# EAGLE schematic control_board (EAGLE 9.5.0)
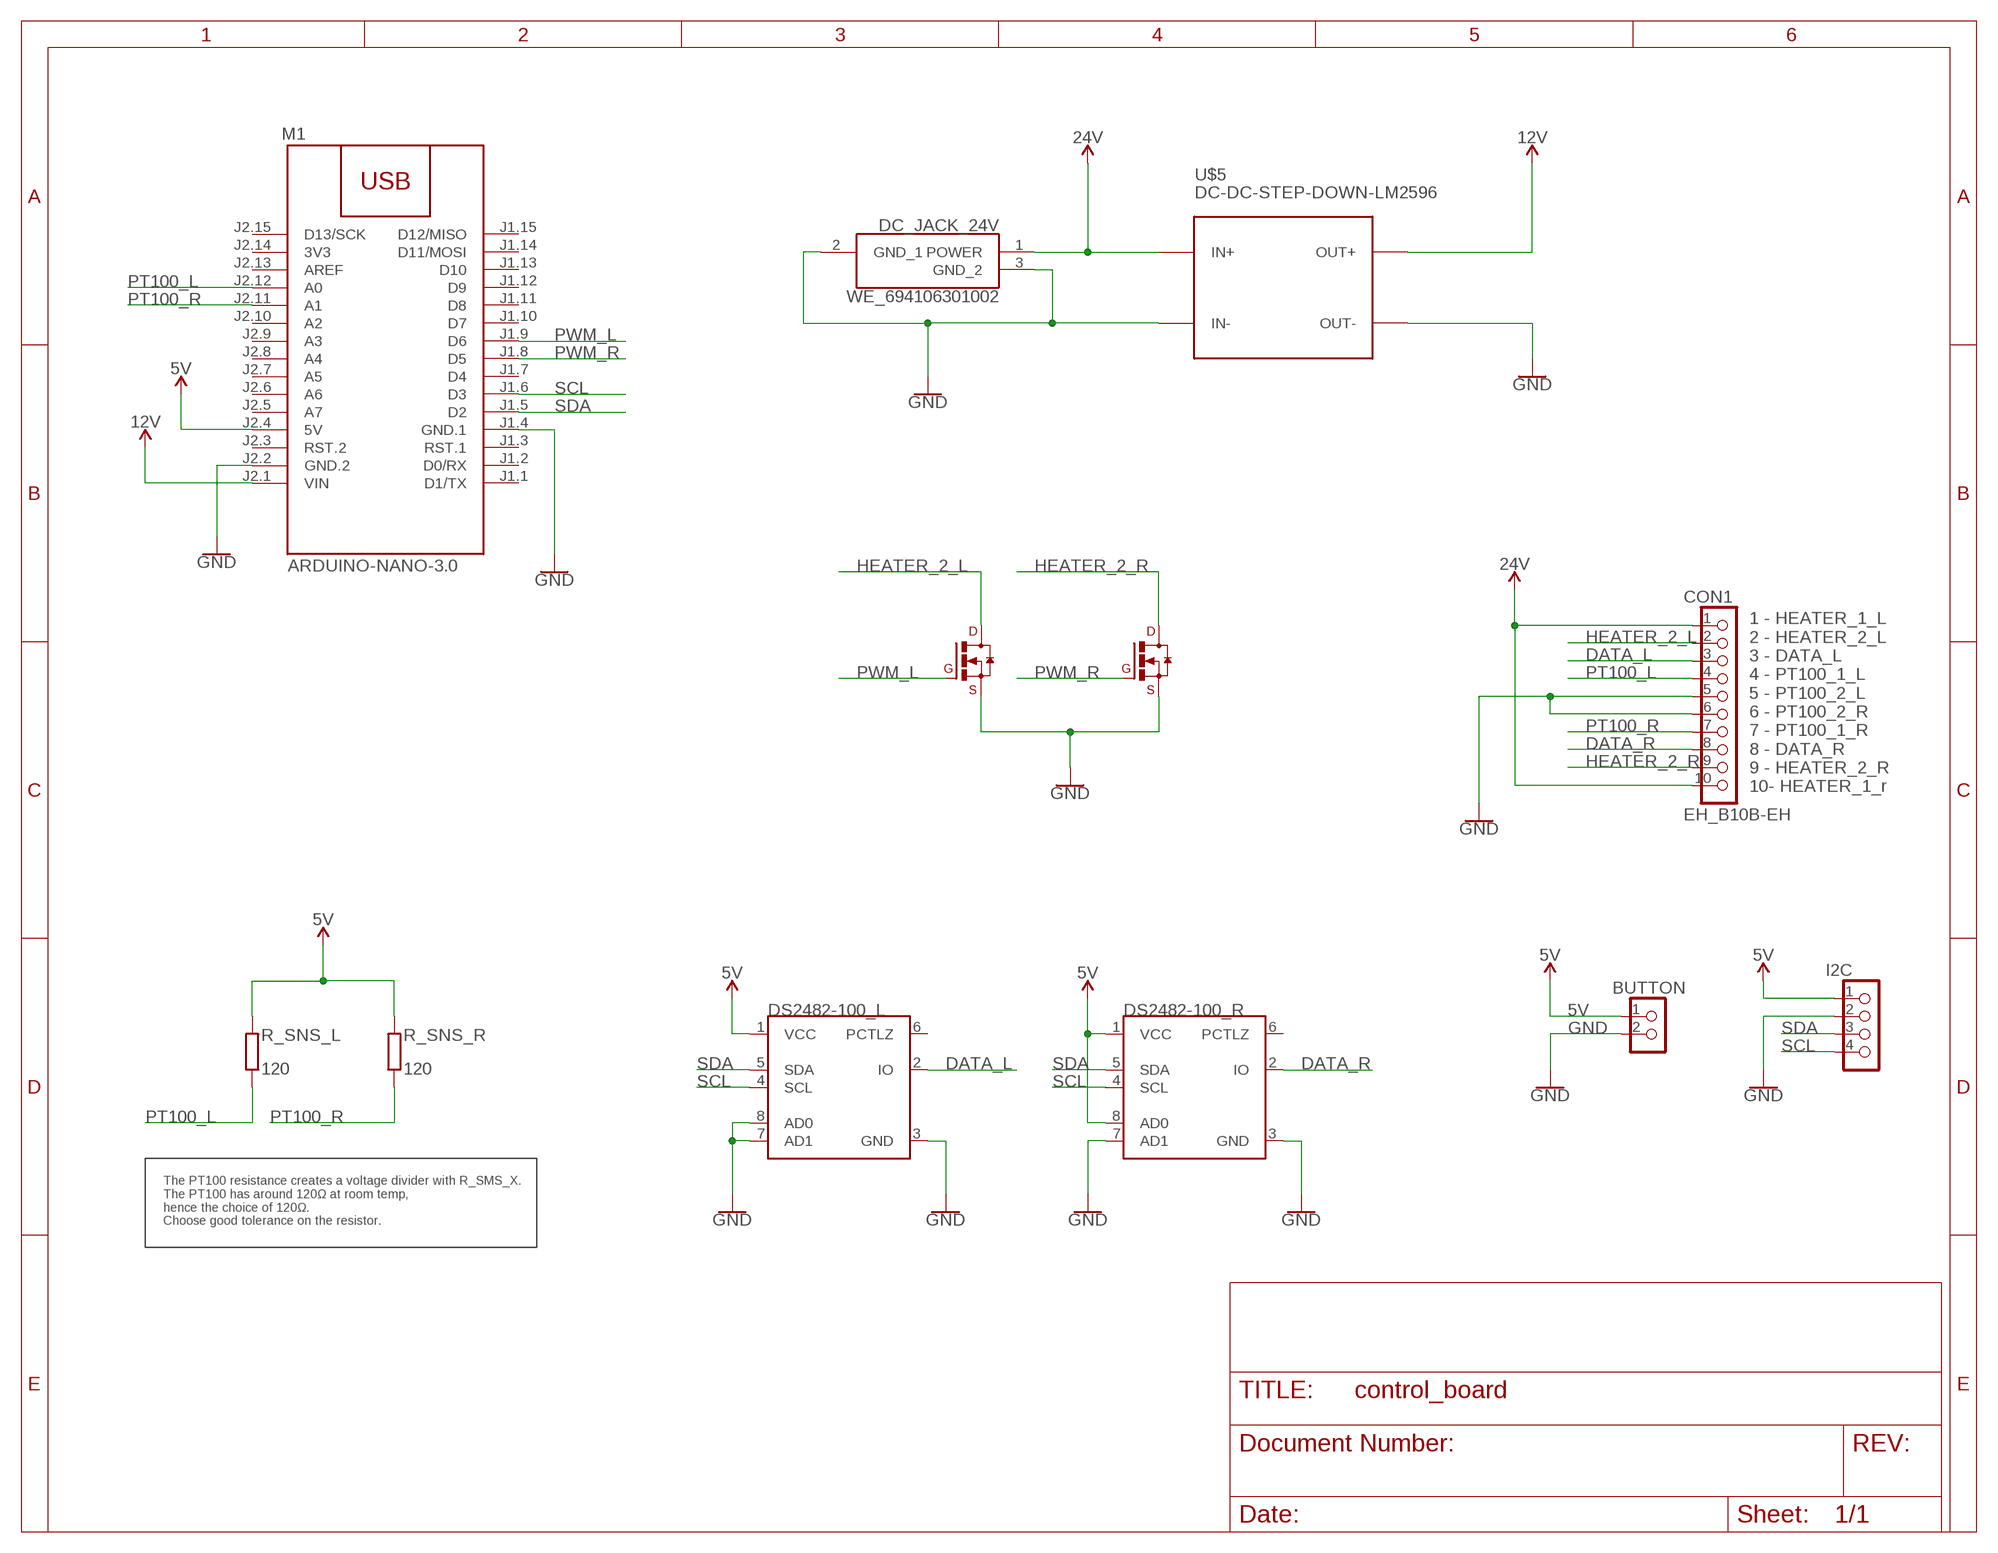
[diagram p0: schematic, sheet 1]

## Parts
BUTTON  EH_B2B-EH  [B2B-EH]
CON1  EH_B10B-EH  [B10B-EH]
DC_JACK_24V  WE_694106301002  [WE_694106301002]
DS2482-100_L  DS2482-100  [SOIC127P600X175-8N]
DS2482-100_R  DS2482-100  [SOIC127P600X175-8N]
I2C  EH_B4B-EH  [B4B-EH]
M1  ARDUINO-NANO-3.0  [ARDUINO-NANO-3.0]
R_SNS_L  120  R1206  [R1206]
R_SNS_R  120  R1206  [R1206]
U$1  DMG4496SSS  [SOIC127P600X175-8N]
U$2  DMG4496SSS  [SOIC127P600X175-8N]
U$5  DC-DC-STEP-DOWN-LM2596  [DC-DC-STEP-DOWN-LM2596]

## Nets
5V: BUTTON.1 DS2482-100_L.1(VCC) DS2482-100_R.1(VCC) DS2482-100_R.8(AD0) I2C.1 M1.J2.4(5V) R_SNS_L.2 R_SNS_R.2
12V: M1.J2.1(VIN) U$5.OUT+
24V: CON1.1 CON1.10 DC_JACK_24V.1(POWER) U$5.IN+
DATA_L: CON1.3 DS2482-100_L.2(IO)
DATA_R: CON1.8 DS2482-100_R.2(IO)
GND: BUTTON.2 CON1.5 CON1.6 DC_JACK_24V.2(GND_1) DC_JACK_24V.3(GND_2) DS2482-100_L.3(GND) DS2482-100_L.7(AD1) DS2482-100_L.8(AD0) DS2482-100_R.3(GND) DS2482-100_R.7(AD1) I2C.2 M1.J1.4(GND.1) M1.J2.2(GND.2) U$1.1(S) U$1.2(S) U$1.3(S) U$2.1(S) U$2.2(S) U$2.3(S) U$5.IN- U$5.OUT-
HEATER_2_L: CON1.2 U$1.5(D) U$1.6(D) U$1.7(D) U$1.8(D)
HEATER_2_R: CON1.9 U$2.5(D) U$2.6(D) U$2.7(D) U$2.8(D)
PT100_L: CON1.4 M1.J2.12(A0) R_SNS_L.1
PT100_R: CON1.7 M1.J2.11(A1) R_SNS_R.1
PWM_L: M1.J1.9(D6) U$1.4(G)
PWM_R: M1.J1.8(D5) U$2.4(G)
SCL: DS2482-100_L.4(SCL) DS2482-100_R.4(SCL) I2C.4 M1.J1.6(D3)
SDA: DS2482-100_L.5(SDA) DS2482-100_R.5(SDA) I2C.3 M1.J1.5(D2)
Unconnected: DS2482-100_L.6(PCTLZ) DS2482-100_R.6(PCTLZ) M1.J1.1(D1/TX) M1.J1.2(D0/RX) M1.J1.3(RST.1) M1.J1.7(D4) M1.J1.10(D7) M1.J1.11(D8) M1.J1.12(D9) M1.J1.13(D10) M1.J1.14(D11/MOSI) M1.J1.15(D12/MISO) M1.J2.3(RST.2) M1.J2.5(A7) M1.J2.6(A6) M1.J2.7(A5) M1.J2.8(A4) M1.J2.9(A3) M1.J2.10(A2) M1.J2.13(AREF) M1.J2.15(D13/SCK)

## Notes on the sheet
- 1 - HEATER_1_L
  2 - HEATER_2_L
  3 - DATA_L
  4 - PT100_1_L
  5 - PT100_2_L
  6 - PT100_2_R
  7 - PT100_1_R
  8 - DATA_R
  9 - HEATER_2_R
  10- HEATER_1_r
- The PT100 resistance creates a voltage divider with R_SMS_X.
  The PT100 has around 120Ω at room temp,
  hence the choice of 120Ω.
  Choose good tolerance on the resistor.

## Power pins joined to a net without a drawn wire
3V3: M1.J2.14(3V3)

## Library data of the parts
BUTTON = CASE-JST:EH_B2B-EH: JST EH Connector, through hole, 2 pin, top entry Description: JST EH connector with 2.5 mm pitch, through hole version, 2 pin, top entry. Links: Datasheet <http://www.jst-mfg.com/product/pdf/eng/eEH.pdf>
CON1 = CASE-JST:EH_B10B-EH: JST EH Connector, through hole, 10 pin, top entry Description: JST EH connector with 2.5 mm pitch, through hole version, 10 pin, top entry. Links: Datasheet <http://www.jst-mfg.com/product/pdf/eng/eEH.pdf>
DC_JACK_24V = CASE_DC-Connector:WE_694106301002: WE 694106301002, DC Power Jack Description: WE 694106301002, DC Power Jack, Horizontal, 5A, 2mm inner diameter, 6.4mm outer diameter Links: Datasheet <https://www.farnell.com/cad/2130967.pdf?_ga=2.136416752.1329853254.1547818753-411290609.1543318711>
DS2482-100_L DS2482-100_R = Isaks Bibliotek:DS2482-100: DS2482-100 Single-Channel 1-Wire Master Datasheet <https://datasheets.maximintegrated.com/en/ds/DS2482-100.pdf>
I2C = CASE-JST:EH_B4B-EH: JST EH Connector, through hole, 4 pin, top entry Description: JST EH connector with 2.5 mm pitch, through hole version, 4 pin, top entry. Links: Datasheet <http://www.jst-mfg.com/product/pdf/eng/eEH.pdf>
M1 = Isaks Bibliotek:ARDUINO-NANO-3.0: Arduino Nano 3.0 and compatible devices More details available here: https://www.arduino.cc/en/Main/ArduinoBoardNano Click here to find device on ebay.com <http://www.ebay.com/sch/arduino+nano>
R_SNS_L R_SNS_R = CASE-RCL:R1206: Standard Chip RESISTOR 1206 (3216 Metric) Description: Standard Chip RESISTOR 1206 (3216 Metric)
U$1 U$2 = Isaks Bibliotek:DMG4496SSS: N-Channel Mosfetfor medium currents.; VENDOR: RS
U$5 = Isaks Bibliotek:DC-DC-STEP-DOWN-LM2596: DC/DC Step-Down Regulator based on LM2596-ADJ chip LM2596 datasheet available here: http://www.ti.com/lit/ds/symlink/lm2596.pdf Click here to find device on ebay.com <http://www.ebay.com/sch/lm2596+power+regulator>